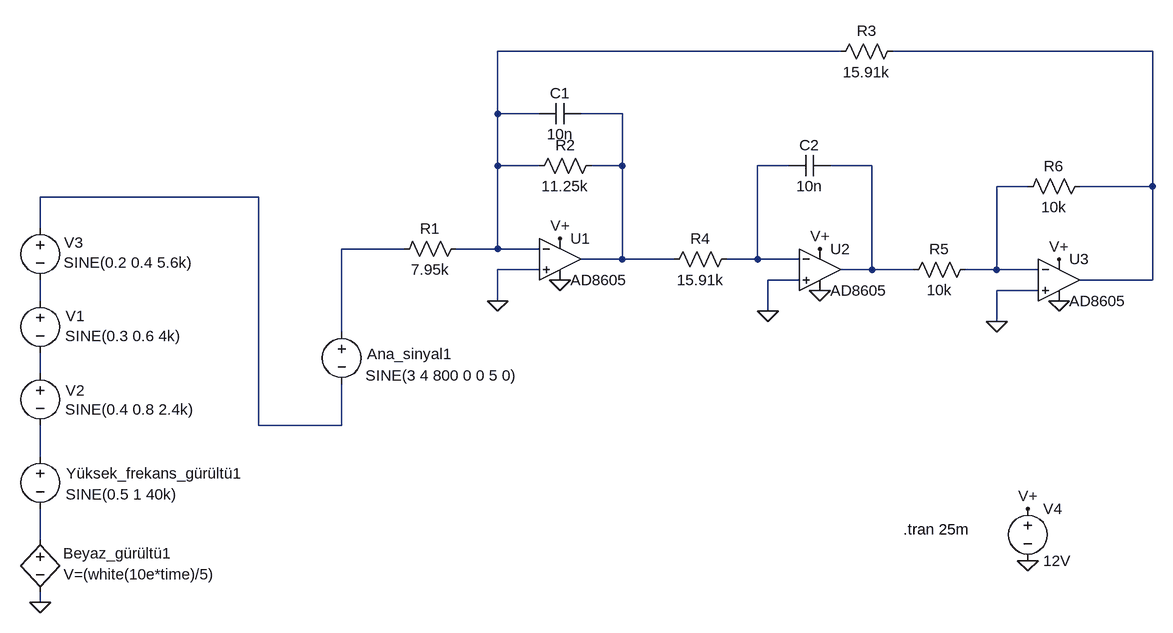
[diagram p0: schematic Tow-Thomas.asc]
Tow-Thomas.asc, the LTspice schematic file:
Version 4
SHEET 1 1016 680
WIRE 528 -224 0 -224
WIRE 1008 -224 608 -224
WIRE 0 -128 0 -224
WIRE 64 -128 0 -128
WIRE 192 -128 128 -128
WIRE 0 -48 0 -128
WIRE 64 -48 0 -48
WIRE 192 -48 192 -128
WIRE 192 -48 144 -48
WIRE 448 -48 400 -48
WIRE 576 -48 512 -48
WIRE 816 -16 768 -16
WIRE 1008 -16 1008 -224
WIRE 1008 -16 896 -16
WIRE -368 0 -704 0
WIRE -704 48 -704 0
WIRE -144 80 -240 80
WIRE 0 80 0 -48
WIRE 0 80 -64 80
WIRE 64 80 0 80
WIRE 192 96 192 -48
WIRE 192 96 128 96
WIRE 272 96 192 96
WIRE 400 96 400 -48
WIRE 400 96 352 96
WIRE 464 96 400 96
WIRE 64 112 0 112
WIRE 576 112 576 -48
WIRE 576 112 528 112
WIRE 640 112 576 112
WIRE 768 112 768 -16
WIRE 768 112 720 112
WIRE 832 112 768 112
WIRE 464 128 416 128
WIRE 1008 128 1008 -16
WIRE 1008 128 896 128
WIRE 832 144 768 144
WIRE -704 160 -704 128
WIRE 0 160 0 112
WIRE 416 176 416 128
WIRE 768 192 768 144
WIRE -240 208 -240 80
WIRE -704 272 -704 240
WIRE -368 352 -368 0
WIRE -240 352 -240 288
WIRE -240 352 -368 352
WIRE -704 400 -704 352
WIRE -704 528 -704 480
WIRE -704 624 -704 608
FLAG 96 64 V+
FLAG -704 624 0
FLAG 96 128 0
FLAG 496 80 V+
FLAG 496 144 0
FLAG 864 96 V+
FLAG 864 160 0
FLAG 0 160 0
FLAG 416 176 0
FLAG 768 192 0
FLAG 816 560 0
FLAG 816 480 V+
SYMBOL res -48 64 R90
WINDOW 0 0 56 VBottom 2
WINDOW 3 32 56 VTop 2
SYMATTR InstName R1
SYMATTR Value 7.95k
SYMBOL voltage -240 192 R0
WINDOW 123 0 0 Left 0
WINDOW 39 0 0 Left 0
WINDOW 3 37 83 Left 2
WINDOW 0 39 50 Left 2
SYMATTR Value SINE(3 4 800 0 0 5 0)
SYMATTR InstName Ana_sinyal1
SYMBOL OpAmps\\AD8605 96 32 R0
SYMATTR InstName U1
SYMBOL bv -704 512 R0
WINDOW 0 35 37 Left 2
WINDOW 3 36 69 Left 2
SYMATTR InstName Beyaz_gürültü1
SYMATTR Value V=(white(10e*time)/5)
SYMBOL voltage -704 144 R0
WINDOW 0 39 39 Left 2
WINDOW 3 38 70 Left 2
WINDOW 123 0 0 Left 0
WINDOW 39 0 0 Left 0
SYMATTR InstName V1
SYMATTR Value SINE(0.3 0.6 4k)
SYMBOL voltage -704 256 R0
WINDOW 0 39 42 Left 2
WINDOW 3 38 71 Left 2
WINDOW 123 0 0 Left 0
WINDOW 39 0 0 Left 0
SYMATTR InstName V2
SYMATTR Value SINE(0.4 0.8 2.4k)
SYMBOL voltage -704 32 R0
WINDOW 0 37 38 Left 2
WINDOW 3 36 69 Left 2
WINDOW 123 0 0 Left 0
WINDOW 39 0 0 Left 0
SYMATTR InstName V3
SYMATTR Value SINE(0.2 0.4 5.6k)
SYMBOL voltage -704 384 R0
WINDOW 0 40 42 Left 2
WINDOW 3 39 74 Left 2
WINDOW 123 0 0 Left 0
WINDOW 39 0 0 Left 0
SYMATTR InstName Yüksek_frekans_gürültü1
SYMATTR Value SINE(0.5 1 40k)
SYMBOL cap 128 -144 R90
WINDOW 0 0 32 VBottom 2
WINDOW 3 32 32 VTop 2
SYMATTR InstName C1
SYMATTR Value 10n
SYMBOL res 160 -64 R90
WINDOW 0 0 56 VBottom 2
WINDOW 3 32 56 VTop 2
SYMATTR InstName R2
SYMATTR Value 11.25k
SYMBOL res 624 -240 R90
WINDOW 0 0 56 VBottom 2
WINDOW 3 32 56 VTop 2
SYMATTR InstName R3
SYMATTR Value 15.91k
SYMBOL res 368 80 R90
WINDOW 0 0 56 VBottom 2
WINDOW 3 32 56 VTop 2
SYMATTR InstName R4
SYMATTR Value 15.91k
SYMBOL res 736 96 R90
WINDOW 0 0 56 VBottom 2
WINDOW 3 32 56 VTop 2
SYMATTR InstName R5
SYMATTR Value 10k
SYMBOL res 912 -32 R90
WINDOW 0 0 56 VBottom 2
WINDOW 3 32 56 VTop 2
SYMATTR InstName R6
SYMATTR Value 10k
SYMBOL OpAmps\\AD8605 496 48 R0
SYMATTR InstName U2
SYMBOL OpAmps\\AD8605 864 64 R0
SYMATTR InstName U3
SYMBOL cap 512 -64 R90
WINDOW 0 0 32 VBottom 2
WINDOW 3 32 32 VTop 2
SYMATTR InstName C2
SYMATTR Value 10n
SYMBOL voltage 816 464 R0
WINDOW 123 0 0 Left 0
WINDOW 39 0 0 Left 0
SYMATTR InstName V4
SYMATTR Value 12V
TEXT 624 512 Left 2 !.tran 25m

The netlist it stands for:
* Tow-Thomas.asc
R1 N001 N008 7.95k
V§Ana_sinyal1 N008 N007 SINE(3 4 800 0 0 5 0)
XU1 0 N001 V+ 0 N003 AD8605  ; pins In+ In- V+ V- OUT
Beyaz_gürültü1 N012 0 V=(white(10e*time)/5)
V1 N009 N010 SINE(0.3 0.6 4k)
V2 N010 N011 SINE(0.4 0.8 2.4k)
V3 N007 N009 SINE(0.2 0.4 5.6k)
V§Yüksek_frekans_gürültü1 N011 N012 SINE(0.5 1 40k)
C1 N003 N001 10n
R2 N003 N001 11.25k
R3 N002 N001 15.91k
R4 N004 N003 15.91k
R5 N006 N005 10k
R6 N002 N006 10k
XU2 0 N004 V+ 0 N005 AD8605  ; pins In+ In- V+ V- OUT
XU3 0 N006 V+ 0 N002 AD8605  ; pins In+ In- V+ V- OUT
C2 N005 N004 10n
V4 V+ 0 12V
.tran 25m
.lib ADI.lib
.backanno
.end